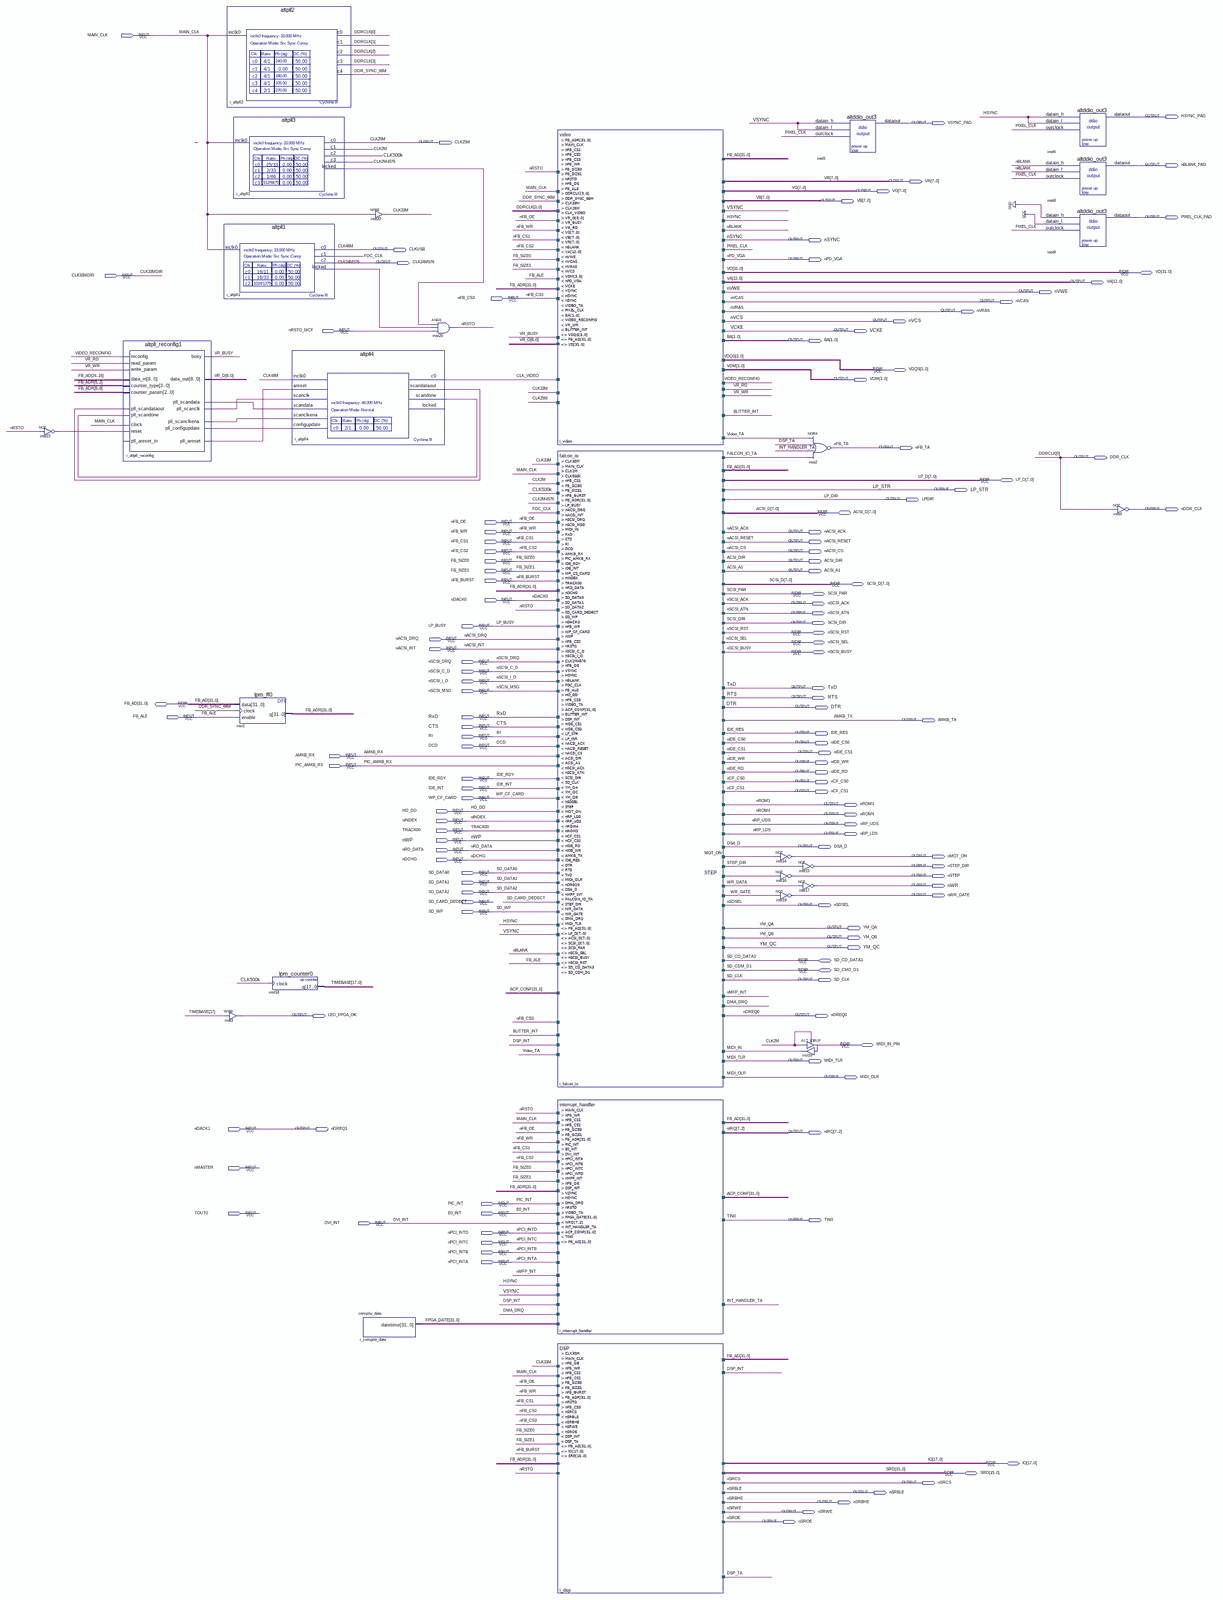
[diagram p0: schematic sheet, whole]
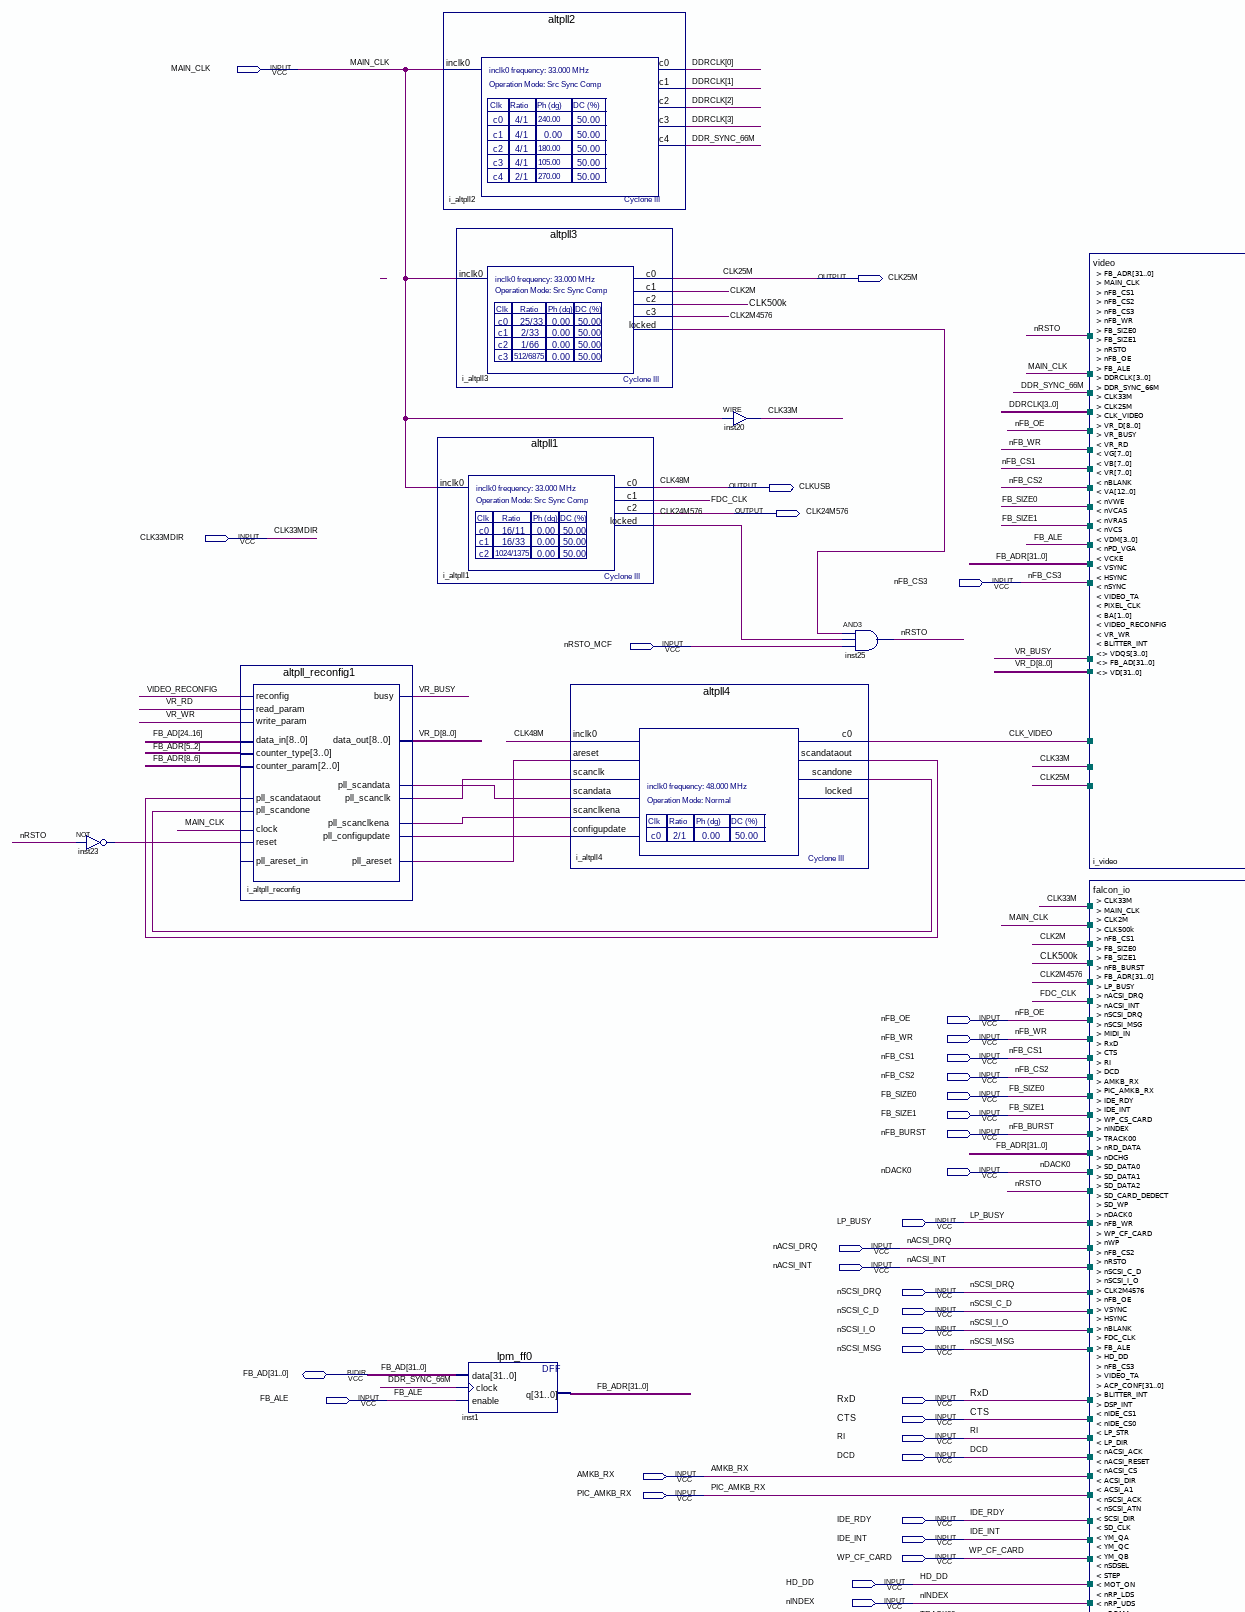
[diagram p1: schematic sheet, upper left part]
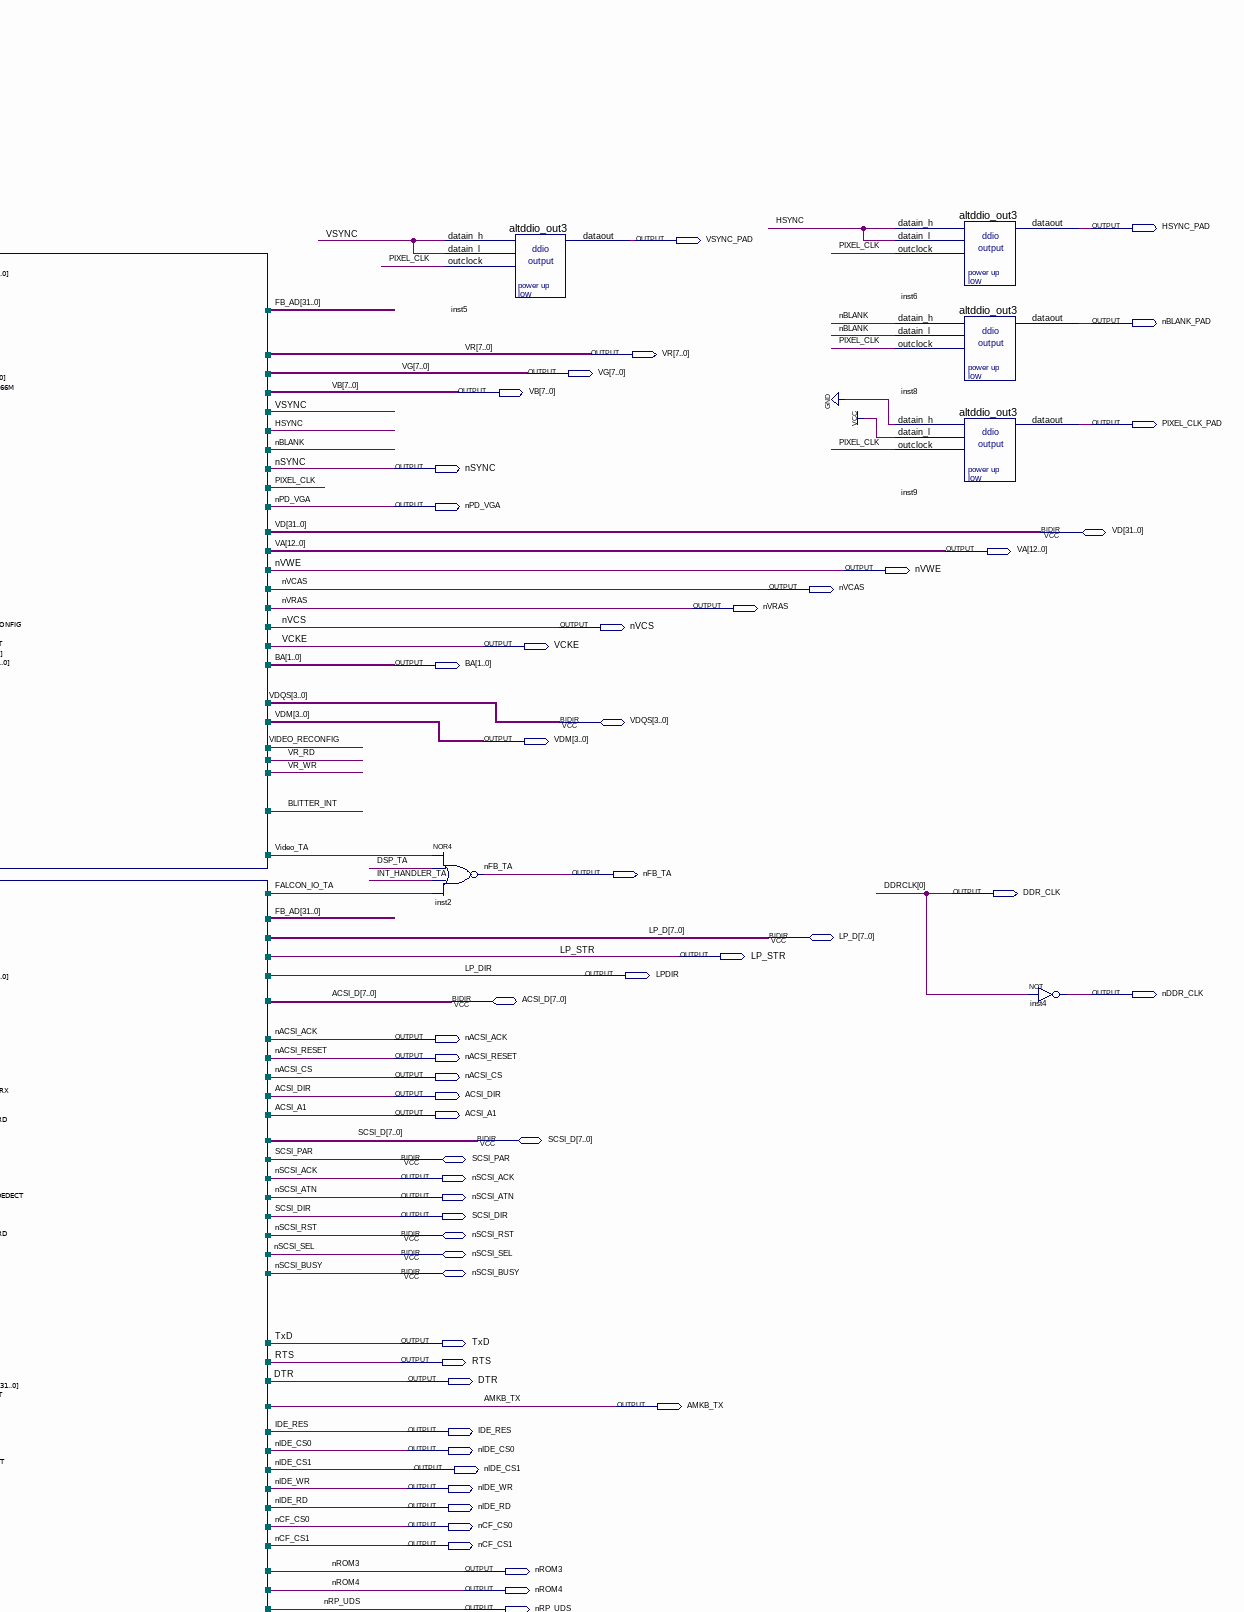
[diagram p2: schematic sheet, upper right part]
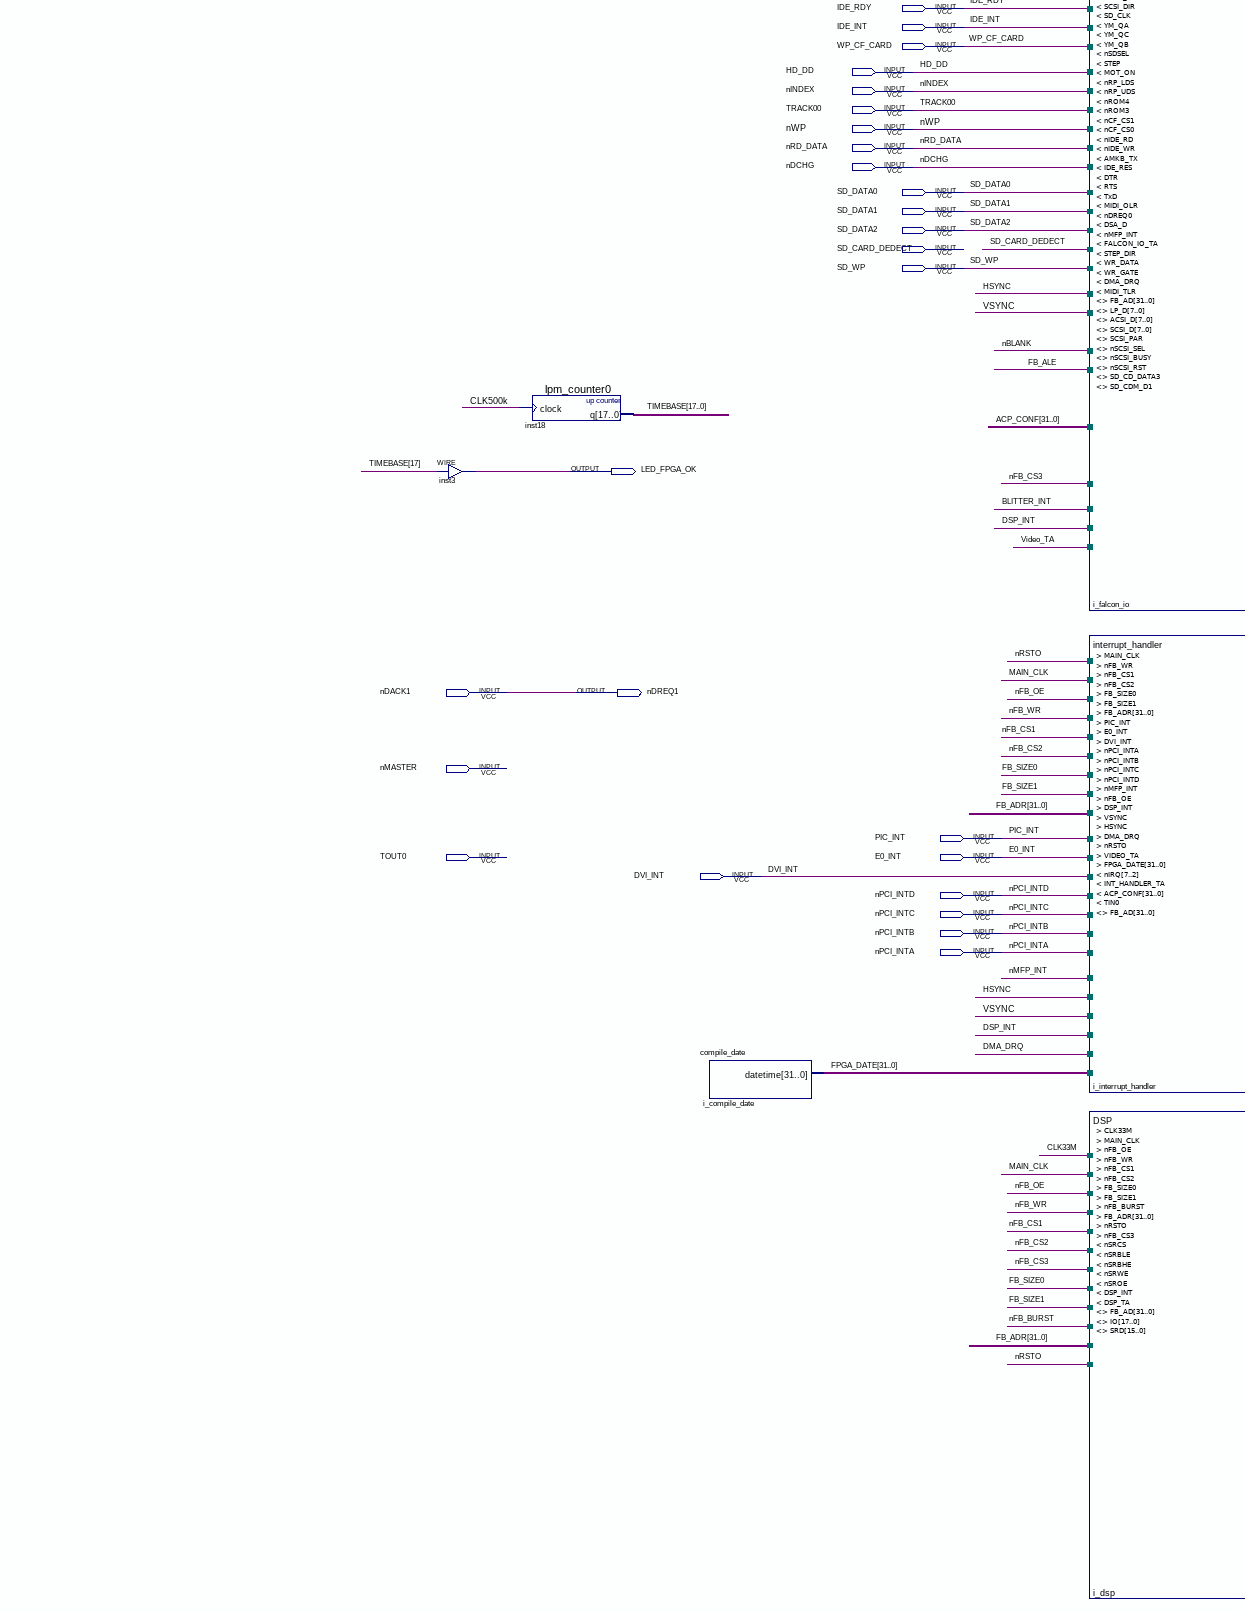
[diagram p3: schematic sheet, lower left part]
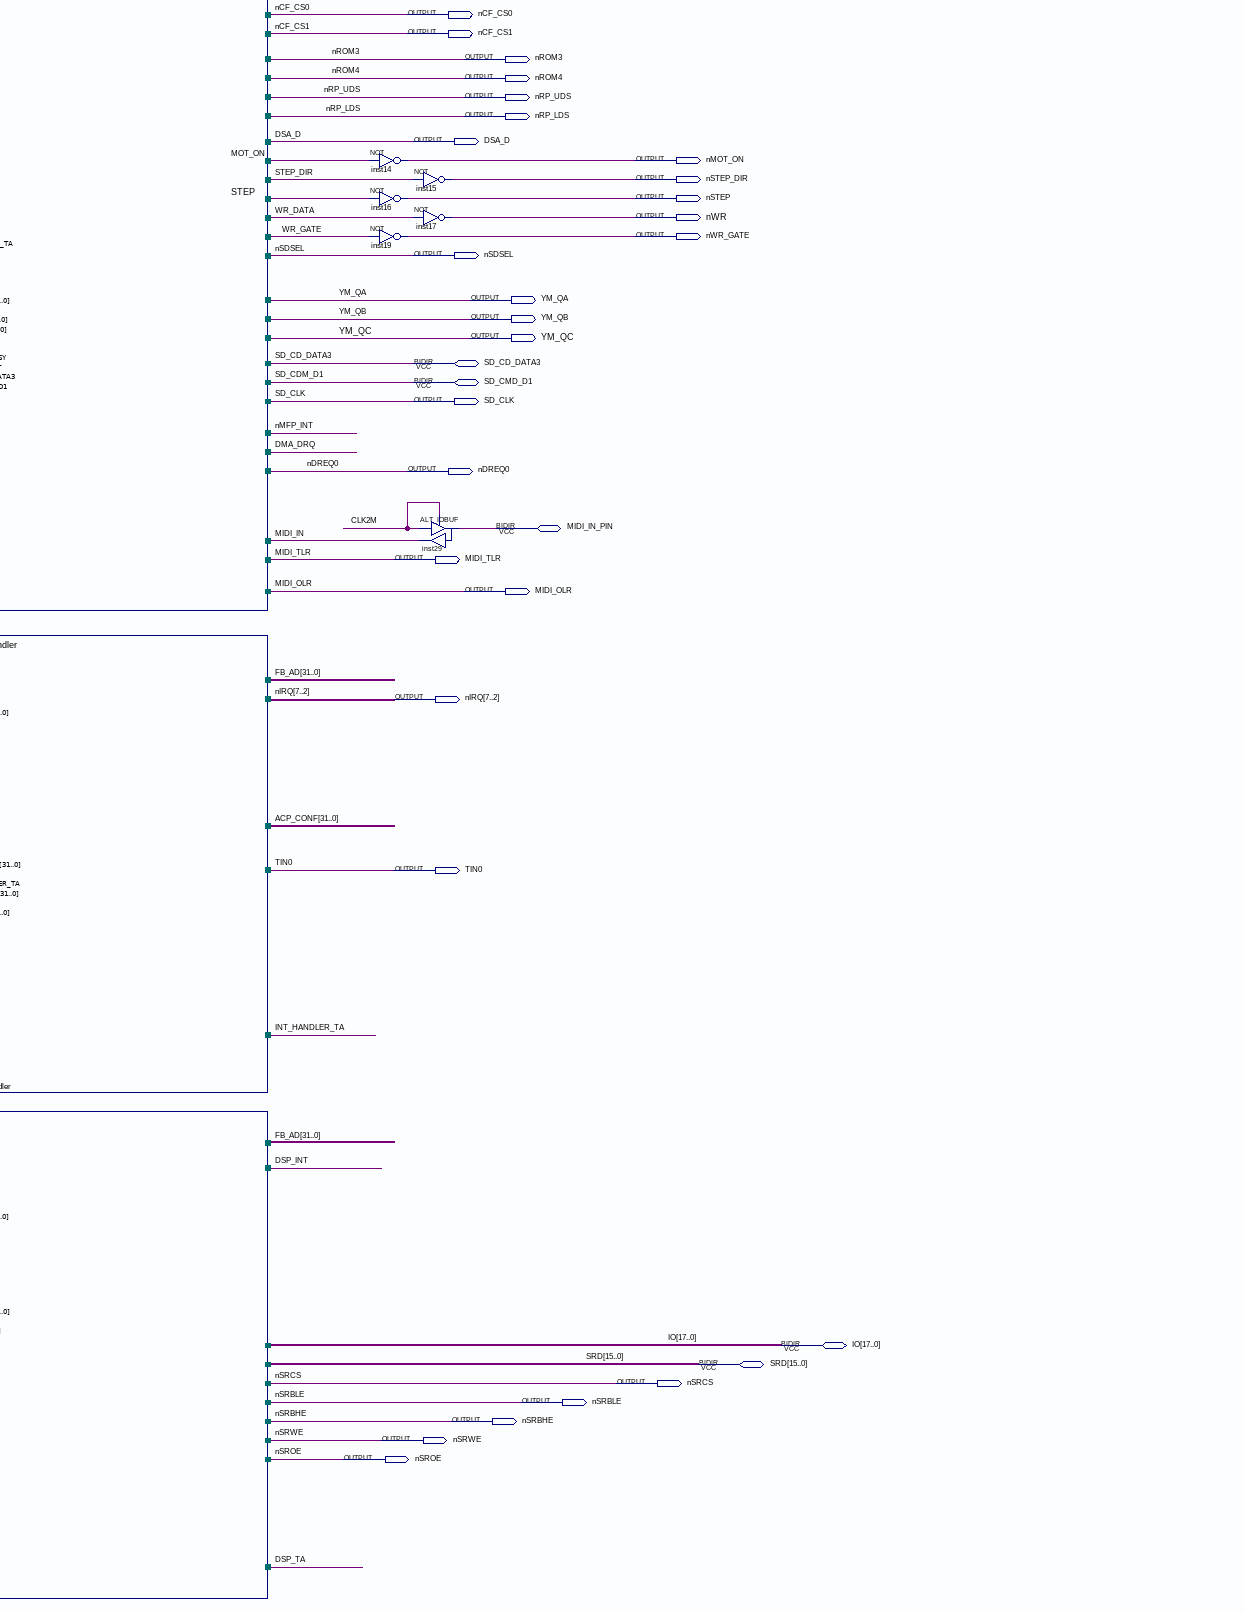
[diagram p4: schematic sheet, lower right part]
// Quartus schematic firebee.bdf as structural Verilog: 28 symbols, 136 pins
module firebee (
  input  MAIN_CLK,
  input  CLK33MDIR,
  input  nFB_CS3,
  input  nRSTO_MCF,
  input  nFB_OE,
  input  nFB_WR,
  input  nFB_CS1,
  input  nFB_CS2,
  input  FB_SIZE0,
  input  FB_SIZE1,
  input  nFB_BURST,
  input  nDACK0,
  input  LP_BUSY,
  input  nACSI_DRQ,
  input  nACSI_INT,
  input  nSCSI_DRQ,
  input  nSCSI_C_D,
  input  nSCSI_I_O,
  input  nSCSI_MSG,
  input  FB_ALE,
  input  RxD,
  input  CTS,
  input  RI,
  input  DCD,
  input  AMKB_RX,
  input  PIC_AMKB_RX,
  input  IDE_RDY,
  input  IDE_INT,
  input  WP_CF_CARD,
  input  HD_DD,
  input  nINDEX,
  input  TRACK00,
  input  nWP,
  input  nRD_DATA,
  input  nDCHG,
  input  SD_DATA0,
  input  SD_DATA1,
  input  SD_DATA2,
  input  SD_CARD_DEDECT,
  input  SD_WP,
  input  nDACK1,
  input  nMASTER,
  input  PIC_INT,
  input  TOUT0,
  input  E0_INT,
  input  DVI_INT,
  input  nPCI_INTD,
  input  nPCI_INTC,
  input  nPCI_INTB,
  input  nPCI_INTA,
  inout  [31:0] VD,
  inout  [3:0] VDQS,
  inout  [7:0] LP_D,
  inout  [7:0] ACSI_D,
  inout  [7:0] SCSI_D,
  inout  SCSI_PAR,
  inout  nSCSI_RST,
  inout  nSCSI_SEL,
  inout  nSCSI_BUSY,
  inout  [31:0] FB_AD,
  inout  SD_CD_DATA3,
  inout  SD_CMD_D1,
  inout  MIDI_IN_PIN,
  inout  [17:0] IO,
  inout  [15:0] SRD,
  output HSYNC_PAD,
  output VSYNC_PAD,
  output CLK25M,
  output nBLANK_PAD,
  output [7:0] VR,
  output [7:0] VG,
  output [7:0] VB,
  output PIXEL_CLK_PAD,
  output nSYNC,
  output CLKUSB,
  output nPD_VGA,
  output CLK24M576,
  output [12:0] VA,
  output nVWE,
  output nVCAS,
  output nVRAS,
  output nVCS,
  output VCKE,
  output [1:0] BA,
  output [3:0] VDM,
  output nFB_TA,
  output DDR_CLK,
  output LP_STR,
  output LPDIR,
  output nDDR_CLK,
  output nACSI_ACK,
  output nACSI_RESET,
  output nACSI_CS,
  output ACSI_DIR,
  output ACSI_A1,
  output nSCSI_ACK,
  output nSCSI_ATN,
  output SCSI_DIR,
  output TxD,
  output RTS,
  output DTR,
  output AMKB_TX,
  output IDE_RES,
  output nIDE_CS0,
  output nIDE_CS1,
  output nIDE_WR,
  output nIDE_RD,
  output nCF_CS0,
  output nCF_CS1,
  output nROM3,
  output nROM4,
  output nRP_UDS,
  output nRP_LDS,
  output DSA_D,
  output nMOT_ON,
  output nSTEP_DIR,
  output nSTEP,
  output nWR,
  output nWR_GATE,
  output nSDSEL,
  output YM_QA,
  output YM_QB,
  output YM_QC,
  output SD_CLK,
  output LED_FPGA_OK,
  output nDREQ0,
  output MIDI_TLR,
  output MIDI_OLR,
  output nDREQ1,
  output [7:2] nIRQ,
  output TIN0,
  output nSRCS,
  output nSRBLE,
  output nSRBHE,
  output nSRWE,
  output nSROE
);

  wire BLITTER_INT, CLK2M, CLK2M4576, CLK33M, CLK500k, CLK_VIDEO, DDR_SYNC_66M, DMA_DRQ, DSP_INT, DSP_TA,
       FALCON_IO_TA, FDC_CLK, HSYNC, i_altpll1_locked, i_altpll3_locked, i_altpll4_scandataout,
       i_altpll4_scandone, i_altpll_reconfig_pll_areset, i_altpll_reconfig_pll_configupdate,
       i_altpll_reconfig_pll_scanclk, i_altpll_reconfig_pll_scanclkena, i_altpll_reconfig_pll_scandata,
       inst23_out, INT_HANDLER_TA, MIDI_IN, MOT_ON, nBLANK, nMFP_INT, nRSTO, PIXEL_CLK, STEP, STEP_DIR,
       VIDEO_RECONFIG, Video_TA, VR_BUSY, VR_RD, VR_WR, VSYNC, WR_DATA, WR_GATE;
  wire [3:1] DDRCLK;
  wire [8:0] VR_D;
  wire [17:0] TIMEBASE;
  wire [31:0] ACP_CONF, FB_ADR, FPGA_DATE;

  not inst23 (inst23_out, nRSTO);
  altpll_reconfig1 i_altpll_reconfig (
    .reconfig(VIDEO_RECONFIG), .read_param(VR_RD), .write_param(VR_WR), .data_in(FB_AD[24:16]),
    .counter_type(FB_ADR[5:2]), .counter_param(FB_ADR[8:6]), .pll_scandataout(i_altpll4_scandataout),
    .pll_scandone(i_altpll4_scandone), .clock(MAIN_CLK), .reset(inst23_out), .busy(VR_BUSY), .data_out(VR_D),
    .pll_scandata(i_altpll_reconfig_pll_scandata), .pll_scanclk(i_altpll_reconfig_pll_scanclk),
    .pll_scanclkena(i_altpll_reconfig_pll_scanclkena), .pll_configupdate(i_altpll_reconfig_pll_configupdate),
    .pll_areset(i_altpll_reconfig_pll_areset));  // open: pll_areset_in
  altpll1 i_altpll1 (.inclk0(MAIN_CLK), .c0(CLKUSB), .c1(FDC_CLK), .c2(CLK24M576), .locked(i_altpll1_locked));
  assign LED_FPGA_OK = TIMEBASE[17];  // WIRE inst3
  altpll2 i_altpll2 (
    .inclk0(MAIN_CLK), .c0(DDR_CLK), .c1(DDRCLK[1]), .c2(DDRCLK[2]), .c3(DDRCLK[3]), .c4(DDR_SYNC_66M));
  altpll3 i_altpll3 (
    .inclk0(MAIN_CLK), .c0(CLK25M), .c1(CLK2M), .c2(CLK500k), .c3(CLK2M4576), .locked(i_altpll3_locked));
  lpm_ff0 inst1 (.data(FB_AD), .clock(DDR_SYNC_66M), .enable(FB_ALE), .q(FB_ADR));
  lpm_counter0 inst18 (.clock(CLK500k), .q(TIMEBASE));
  altpll4 i_altpll4 (
    .inclk0(CLKUSB), .areset(i_altpll_reconfig_pll_areset), .scanclk(i_altpll_reconfig_pll_scanclk),
    .scandata(i_altpll_reconfig_pll_scandata), .scanclkena(i_altpll_reconfig_pll_scanclkena),
    .configupdate(i_altpll_reconfig_pll_configupdate), .c0(CLK_VIDEO), .scandataout(i_altpll4_scandataout),
    .scandone(i_altpll4_scandone));  // open: locked
  assign CLK33M = MAIN_CLK;  // WIRE inst20
  compile_date i_compile_date (.datetime(FPGA_DATE));
  and inst25 (nRSTO, i_altpll3_locked, i_altpll1_locked, nRSTO_MCF);
  video i_video (
    .FB_ADR(FB_ADR), .MAIN_CLK(MAIN_CLK), .nFB_CS1(nFB_CS1), .nFB_CS2(nFB_CS2), .nFB_CS3(nFB_CS3),
    .nFB_WR(nFB_WR), .FB_SIZE0(FB_SIZE0), .FB_SIZE1(FB_SIZE1), .nRSTO(nRSTO), .nFB_OE(nFB_OE),
    .FB_ALE(FB_ALE), .DDRCLK({DDRCLK, DDR_CLK}), .DDR_SYNC_66M(DDR_SYNC_66M), .CLK33M(CLK33M),
    .CLK25M(CLK25M), .CLK_VIDEO(CLK_VIDEO), .VR_D(VR_D), .VR_BUSY(VR_BUSY), .VR_RD(VR_RD), .VG(VG), .VB(VB),
    .VR(VR), .nBLANK(nBLANK), .VA(VA), .nVWE(nVWE), .nVCAS(nVCAS), .nVRAS(nVRAS), .nVCS(nVCS), .VDM(VDM),
    .nPD_VGA(nPD_VGA), .VCKE(VCKE), .VSYNC(VSYNC), .HSYNC(HSYNC), .nSYNC(nSYNC), .VIDEO_TA(Video_TA),
    .PIXEL_CLK(PIXEL_CLK), .BA(BA), .VIDEO_RECONFIG(VIDEO_RECONFIG), .VR_WR(VR_WR),
    .BLITTER_INT(BLITTER_INT), .VDQS(VDQS), .FB_AD(FB_AD), .VD(VD));
  falcon_io i_falcon_io (
    .CLK33M(CLK33M), .MAIN_CLK(MAIN_CLK), .CLK2M(CLK2M), .CLK500k(CLK500k), .nFB_CS1(nFB_CS1),
    .FB_SIZE0(FB_SIZE0), .FB_SIZE1(FB_SIZE1), .nFB_BURST(nFB_BURST), .FB_ADR(FB_ADR), .LP_BUSY(LP_BUSY),
    .nACSI_DRQ(nACSI_DRQ), .nACSI_INT(nACSI_INT), .nSCSI_DRQ(nSCSI_DRQ), .nSCSI_MSG(nSCSI_MSG),
    .MIDI_IN(MIDI_IN), .RxD(RxD), .CTS(CTS), .RI(RI), .DCD(DCD), .AMKB_RX(AMKB_RX),
    .PIC_AMKB_RX(PIC_AMKB_RX), .IDE_RDY(IDE_RDY), .IDE_INT(IDE_INT), .nINDEX(nINDEX), .TRACK00(TRACK00),
    .nRD_DATA(nRD_DATA), .nDCHG(nDCHG), .SD_DATA0(SD_DATA0), .SD_DATA1(SD_DATA1), .SD_DATA2(SD_DATA2),
    .SD_CARD_DEDECT(SD_CARD_DEDECT), .SD_WP(SD_WP), .nDACK0(nDACK0), .nFB_WR(nFB_WR),
    .WP_CF_CARD(WP_CF_CARD), .nWP(nWP), .nFB_CS2(nFB_CS2), .nRSTO(nRSTO), .nSCSI_C_D(nSCSI_C_D),
    .nSCSI_I_O(nSCSI_I_O), .CLK2M4576(CLK2M4576), .nFB_OE(nFB_OE), .VSYNC(VSYNC), .HSYNC(HSYNC),
    .nBLANK(nBLANK), .FDC_CLK(FDC_CLK), .FB_ALE(FB_ALE), .HD_DD(HD_DD), .nFB_CS3(nFB_CS3),
    .VIDEO_TA(Video_TA), .ACP_CONF(ACP_CONF), .BLITTER_INT(BLITTER_INT), .DSP_INT(DSP_INT),
    .nIDE_CS1(nIDE_CS1), .nIDE_CS0(nIDE_CS0), .LP_STR(LP_STR), .LP_DIR(LPDIR), .nACSI_ACK(nACSI_ACK),
    .nACSI_RESET(nACSI_RESET), .nACSI_CS(nACSI_CS), .ACSI_DIR(ACSI_DIR), .ACSI_A1(ACSI_A1),
    .nSCSI_ACK(nSCSI_ACK), .nSCSI_ATN(nSCSI_ATN), .SCSI_DIR(SCSI_DIR), .SD_CLK(SD_CLK), .YM_QA(YM_QA),
    .YM_QC(YM_QC), .YM_QB(YM_QB), .nSDSEL(nSDSEL), .STEP(STEP), .MOT_ON(MOT_ON), .nRP_LDS(nRP_LDS),
    .nRP_UDS(nRP_UDS), .nROM4(nROM4), .nROM3(nROM3), .nCF_CS1(nCF_CS1), .nCF_CS0(nCF_CS0), .nIDE_RD(nIDE_RD),
    .nIDE_WR(nIDE_WR), .AMKB_TX(AMKB_TX), .IDE_RES(IDE_RES), .DTR(DTR), .RTS(RTS), .TxD(TxD),
    .MIDI_OLR(MIDI_OLR), .nDREQ0(nDREQ0), .DSA_D(DSA_D), .nMFP_INT(nMFP_INT), .FALCON_IO_TA(FALCON_IO_TA),
    .STEP_DIR(STEP_DIR), .WR_DATA(WR_DATA), .WR_GATE(WR_GATE), .DMA_DRQ(DMA_DRQ), .MIDI_TLR(MIDI_TLR),
    .FB_AD(FB_AD), .LP_D(LP_D), .ACSI_D(ACSI_D), .SCSI_D(SCSI_D), .SCSI_PAR(SCSI_PAR), .nSCSI_SEL(nSCSI_SEL),
    .nSCSI_BUSY(nSCSI_BUSY), .nSCSI_RST(nSCSI_RST), .SD_CD_DATA3(SD_CD_DATA3), .SD_CDM_D1(SD_CMD_D1));  // open: WP_CS_CARD
  interrupt_handler i_interrupt_handler (
    .MAIN_CLK(MAIN_CLK), .nFB_WR(nFB_WR), .nFB_CS1(nFB_CS1), .nFB_CS2(nFB_CS2), .FB_SIZE0(FB_SIZE0),
    .FB_SIZE1(FB_SIZE1), .FB_ADR(FB_ADR), .PIC_INT(PIC_INT), .E0_INT(E0_INT), .DVI_INT(DVI_INT),
    .nPCI_INTA(nPCI_INTA), .nPCI_INTB(nPCI_INTB), .nPCI_INTC(nPCI_INTC), .nPCI_INTD(nPCI_INTD),
    .nMFP_INT(nMFP_INT), .nFB_OE(nFB_OE), .DSP_INT(DSP_INT), .VSYNC(VSYNC), .HSYNC(HSYNC), .DMA_DRQ(DMA_DRQ),
    .nRSTO(nRSTO), .FPGA_DATE(FPGA_DATE), .nIRQ(nIRQ), .INT_HANDLER_TA(INT_HANDLER_TA), .ACP_CONF(ACP_CONF),
    .TIN0(TIN0), .FB_AD(FB_AD));  // open: VIDEO_TA
  DSP i_dsp (
    .CLK33M(CLK33M), .MAIN_CLK(MAIN_CLK), .nFB_OE(nFB_OE), .nFB_WR(nFB_WR), .nFB_CS1(nFB_CS1),
    .nFB_CS2(nFB_CS2), .FB_SIZE0(FB_SIZE0), .FB_SIZE1(FB_SIZE1), .nFB_BURST(nFB_BURST), .FB_ADR(FB_ADR),
    .nRSTO(nRSTO), .nFB_CS3(nFB_CS3), .nSRCS(nSRCS), .nSRBLE(nSRBLE), .nSRBHE(nSRBHE), .nSRWE(nSRWE),
    .nSROE(nSROE), .DSP_INT(DSP_INT), .DSP_TA(DSP_TA), .FB_AD(FB_AD), .IO(IO), .SRD(SRD));
  not inst14 (nMOT_ON, MOT_ON);
  not inst16 (nSTEP, STEP);
  not inst19 (nWR_GATE, WR_GATE);
  altddio_out3 inst5 (.datain_h(VSYNC), .datain_l(VSYNC), .outclock(PIXEL_CLK), .dataout(VSYNC_PAD));
  nor inst2 (nFB_TA, Video_TA, DSP_TA, INT_HANDLER_TA, FALCON_IO_TA);
  not inst15 (nSTEP_DIR, STEP_DIR);
  not inst17 (nWR, WR_DATA);
  ALT_IOBUF inst29 (.i(CLK2M), .oe(CLK2M), .o(MIDI_IN), .io(MIDI_IN_PIN));
  altddio_out3 inst6 (.datain_h(HSYNC), .datain_l(HSYNC), .outclock(PIXEL_CLK), .dataout(HSYNC_PAD));
  altddio_out3 inst8 (.datain_h(nBLANK), .datain_l(nBLANK), .outclock(PIXEL_CLK), .dataout(nBLANK_PAD));
  altddio_out3 inst9 (.datain_h(1'b0), .datain_l(1'b1), .outclock(PIXEL_CLK), .dataout(PIXEL_CLK_PAD));
  not inst4 (nDDR_CLK, DDR_CLK);

  assign nDREQ1 = nDACK1;

  // Other names for the same wires on the sheet: CLK48M = CLKUSB; DDRCLK[0] = DDR_CLK; LP_DIR = LPDIR;
  //   SD_CDM_D1 = SD_CMD_D1
endmodule
